# Altium schematic sheet DRV RL20 V3.schdoc
size A4; SheetNumber: 1; SheetTotal: 1
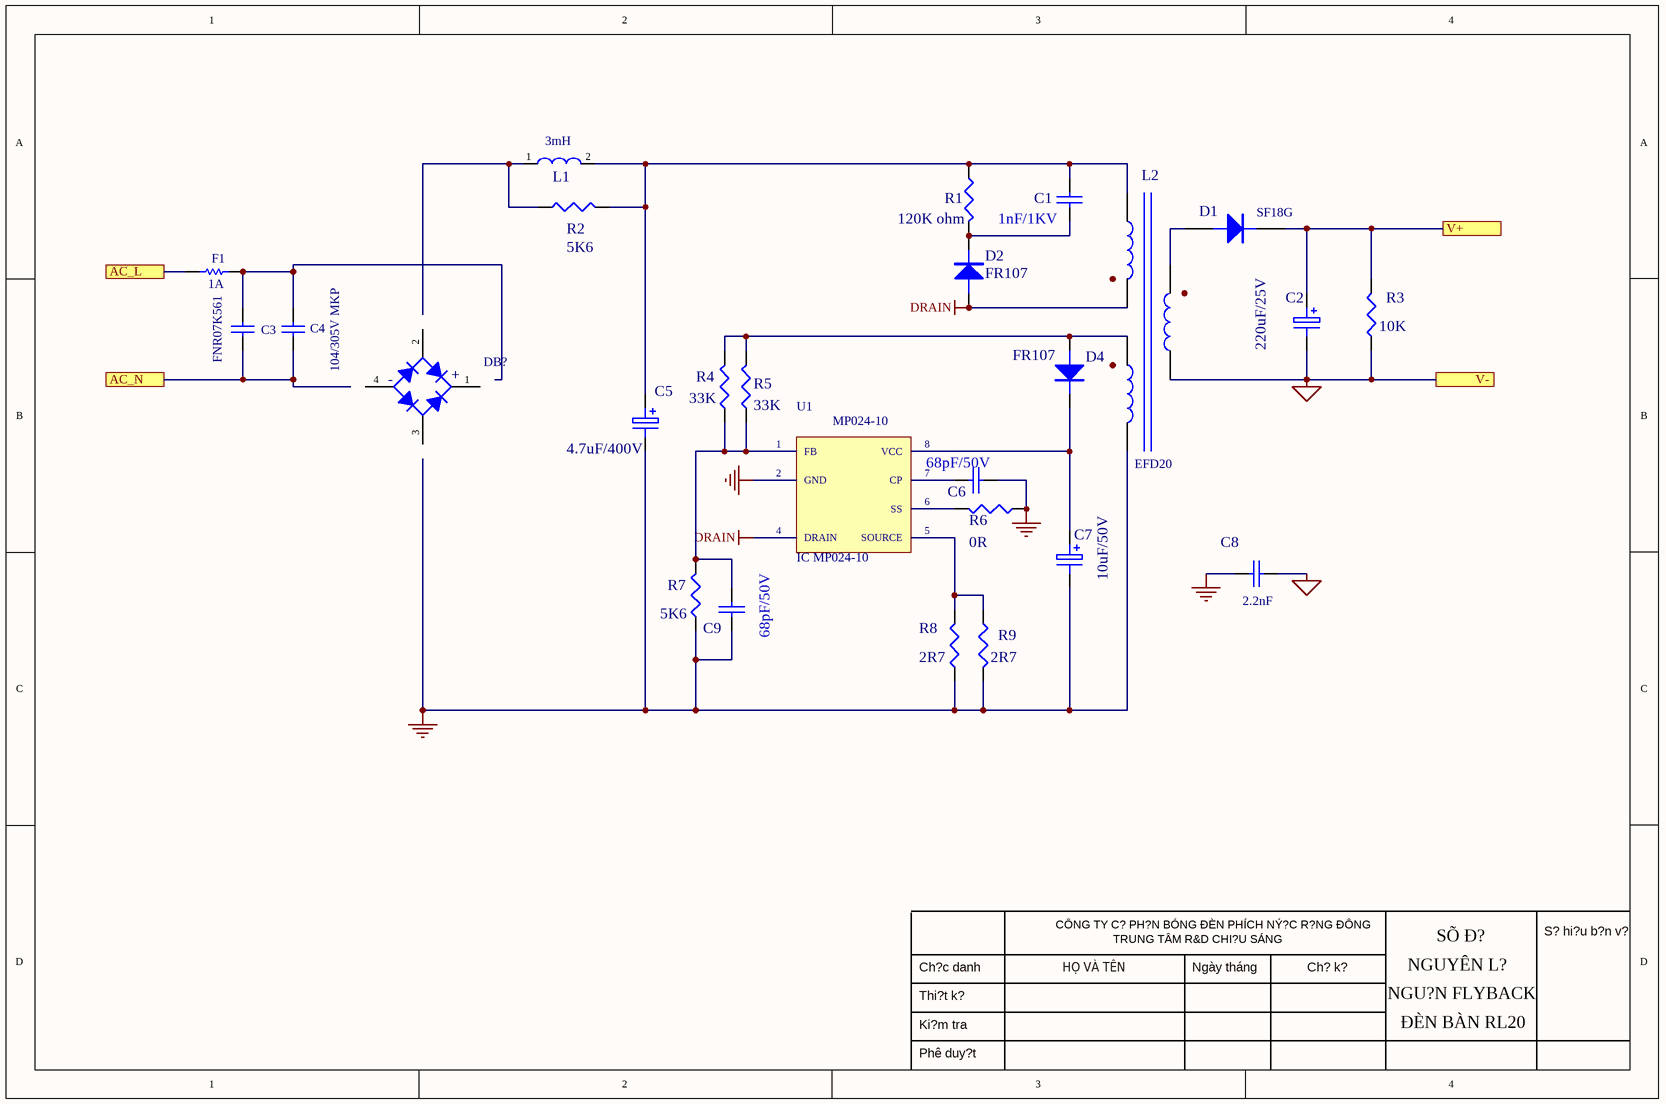
[diagram p0: DRV RL20 V3.schdoc]

## Parts
C1  1nF/1KV  [0805]
C2  220uF/25V  [EC8*10]
C3  FNR07K561  [varistor 7K561]
C4  104/305V MKP  [tu AC 104 305VAC]
C5  4.7uF/400V  [EC8*10]
C6  68pF/50V  [0805]
C7  10uF/50V  [EC4-2]
C8  2.2nF  [TU CACH LY-P10]
C9  68pF/50V  [0805]
D1  SF18G  [SMA]
D2  FR107  [SOD123]
D4  FR107  [SOD123]
DB?  Diode DB  [Diode ABS]  (value not drawn)
F1  1A  [cau tri 1 A nam]
L1  3mH  [L1]
L2  EFD20  [EE13]
R1  120K ohm  [0805]
R2  5K6  [1206]
R3  10K  [0805]
R4  33K  [0805]
R5  33K  [0805]
R6  0R  [0805]
R7  5K6  [0603-N]
R8  2R7  [0805]
R9  2R7  [0805]
U1  IC MP024-10  [IC MP024-10]

## Ports
AC_L, AC_N, V+, V-

## Nets
DRAIN: D2.1(A) L2.2 U1.4(DRAIN)
GND: C5.2 C6.2 C7.2 C8.1 C9.2 L2.8 R6.2 R7.2 R8.1 R9.2 U1.2(GND)
GND2: C2.2 C8.2 L2.B R3.1 ; port V-
AC_L: F1.2 ; port AC_L
AC_N: C3.2 C4.2 ; port AC_N
V+: C2.1 D1.2(K) R3.2 ; port V+
NetC1_1: C1.1 C5.1 L1.2 L2.1 R1.1 R2.2
NetC1_2: C1.2 D2.2(K) R1.2
NetC3_1: C3.1 C4.1 F1.1
NetC6_1: C6.1 U1.7(CP)
NetC7_1: C7.1 D4.2(K) U1.8(VCC)
NetC9_1: C9.1 R4.2 R5.2 R7.1 U1.1(FB)
NetD1_1: D1.1(A) L2.A
NetD4_1: D4.1(A) L2.3 R4.1 R5.1
NetL1_1: L1.1 R2.1
NetR6_1: R6.1 U1.6(SS)
NetR8_2: R8.2 R9.1 U1.5(SOURCE)

Not connected (* = marked no-connect by the designer): DB? 1(+) 2(AC) 3(AC) 4(-)

## Notes on the sheet
- Ch?c danh
- CÔNG TY C? PH?N BÓNG ÐÈN PHÍCH NÝ?C R?NG ÐÔNG
- HỌ VÀ TÊN
- TRUNG TÂM R&D CHI?U SÁNG
- Ngày tháng
- Ch? k?
- NGUYÊN L?
- SÕ Ð?
- S? hi?u b?n v?
- Ki?m tra
- Thi?t k?
- NGU?N FLYBACK
- ÐÈN BÀN RL20
- Phê duy?t
- (in symbol IC MP024-10) MP024-10

## Library data of the parts
C1 C6 C8 C9 = CAP: Capacitor
C2 C5 C7 = ELECTRO0
C3 C4 = Cap: Capacitor
D1 = DIODE
D2 D4 = DIODE0
F1 = Res: Resistor
L1 = INDUCTOR1
L2 = TRANS-EE
R1-R9 = RES1A